# Altium schematic sheet Pressure Sensor.SchDoc: Pressure Sensor
size A4; SheetNumber: 32; SheetTotal: 37
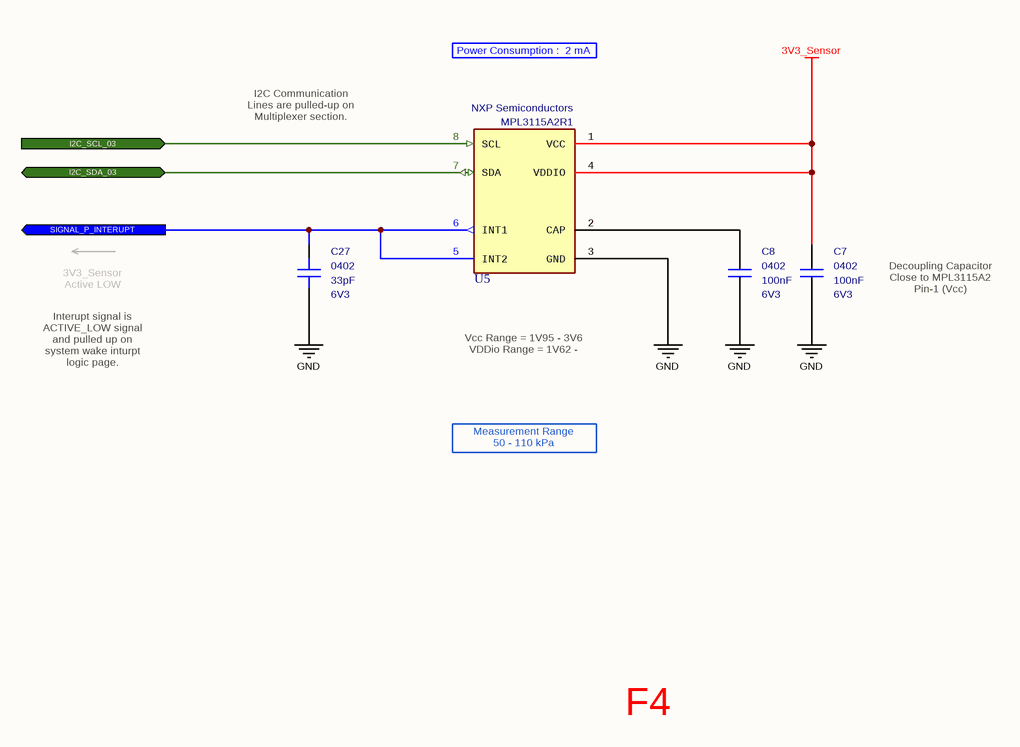
[diagram p0: Pressure Sensor.SchDoc]

## Parts
C7  value 100nF  Case: 0402  Voltage: 6V3  [CAPACITOR_0402]  (hidden comment: Multilayer Ceramic Capacitor)
C8  value 100nF  Case: 0402  Voltage: 6V3  [CAPACITOR_0402]  (hidden comment: Multilayer Ceramic Capacitor)
C27  value 33pF  Case: 0402  Voltage: 6V3  [CAPACITOR_0402]  (hidden comment: Multilayer Ceramic Capacitor)
U5  Manufacturer_Part_Number: MPL3115A2R1  Manufacturer_Name: NXP Semiconductors  [MPL3115A2]  (hidden comment: Board Mount Pressure Sensors)

## Ports
I2C_SCL_03 (in), I2C_SDA_03 (bidir), SIGNAL_P_INTERUPT (out)

## Nets
3V3_Sensor: C7.2 U5.1(VCC) U5.4(VDDIO)
GND: C7.1 C8.1 C27.1 U5.3(GND)
I2C_SCL_03: U5.8(SCL) ; port I2C_SCL_03
I2C_SDA_03: U5.7(SDA) ; port I2C_SDA_03
SIGNAL_P_INTERUPT: C27.2 U5.5(INT2) U5.6(INT1) ; port SIGNAL_P_INTERUPT
NetC8_2: C8.2 U5.2(CAP)

## Notes on the sheet
- Power Consumption :  2 mA
- I2C Communication Lines are pulled-up on Multiplexer section.
- 3V3_Sensor
  Active LOW
- Decoupling Capacitor
  Close to MPL3115A2
  Pin-1 (Vcc)
- Interupt signal is ACTIVE_LOW signal and pulled up on system wake inturpt logic page.
- Vcc Range = 1V95 - 3V6
  VDDio Range = 1V62 - 3V6
- Measurement Range
  50 - 110 kPa
- F4
- Title
- Size:
- Date:
- A4
- Number:
- Time:
- Revision:
- Sheet
- of
- File:

## Library data of the parts
C7 C8 = Capacitor - 100nF [0402-6V3]: Capacitor - 100nF [0402-6V3] (Ceramic); Manufacturer_Name: AVX; Manufacturer_Part_Number: 04026D104KAT4A; Dielectric: X5R; Tolerance: %10; Height: 0.25mm; Mouser_Part_Number: 581-04026D104KAT4A; ComponentLink1Description: Mouser; ComponentLink1URL: https://www.mouser.com.tr/ProductDetail/AVX/04026D104KAT4A?qs=sGAEpiMZZMs0AnBnWHyRQPg4iYkCw7IMED%2F4kpqgf7w%3D; ComponentLink2Description: DataSheet; ComponentLink2URL: https://www.mouser.com.tr/datasheet/2/40/cx5r-776519.pdf; ROHS: Yes; Maximum Operating Temperature: +85; Minimum Operating Temperature: -55; Supplier 1: Avnet; Supplier Part Number 1: 04026D104KAT4A
C27 = Capacitor - 33pF [0402-6V3]: Capacitor - 33pF [0402] (Ceramic); Manufacturer_Name: Kemet; Manufacturer_Part_Number: C0402C330J9RACAUTO; Dielectric: X7R; Tolerance: 10%; Height: 0.5mm; Mouser_Part_Number: 80-C0402C330J9RAUTO; Maximum Operating Temperature: +125; Minimum Operating Temperature: -55; ROHS: Yes; ComponentLink1Description: DataSheet; ComponentLink1URL: https://api.kemet.com/component-edge/download/datasheet/C0402C330J9RACAUTO.pdf; ComponentLink2Description: Mouser; ComponentLink2URL: https://www.mouser.com/Search/Refine.aspx?Keyword=80-C0402C330J9RAUTO; Supplier 1: Mouser; Supplier Part Number 1: 80-C0402C330J9RAUTO
U5 = IC - MPL3115A2R1: Board Mount Pressure Sensors I 2 C VERSION; Mouser Part Number: 841-MPL3115A2R1; ComponentLink1Description: DataSheet; ComponentLink1URL: https://www.mouser.com.tr/datasheet/2/302/MPL3115A2-1127148.pdf; ComponentLink2Description: Mouser; ComponentLink2URL: https://www.mouser.com.tr/ProductDetail/NXP-Semiconductors/MPL3115A2R1?qs=6ddF3R%2F6EV%2Fx8daKoNGetQ%3D%3D; Minimum Operating Temperature: -40; Maximum Operating Temperature: +85; Case: SMD; Supplier 1: Farnell; Supplier Part Number 1: 2890337